# EasyEDA schematic SCH_OnboardRobot_2024-01-02.json
TITLE: Sheet_1; REV: 1.0; Date: 2023-12-17; Sheet: 1/1; Drawn By: RaspberryPiDude314; Company: Your Company
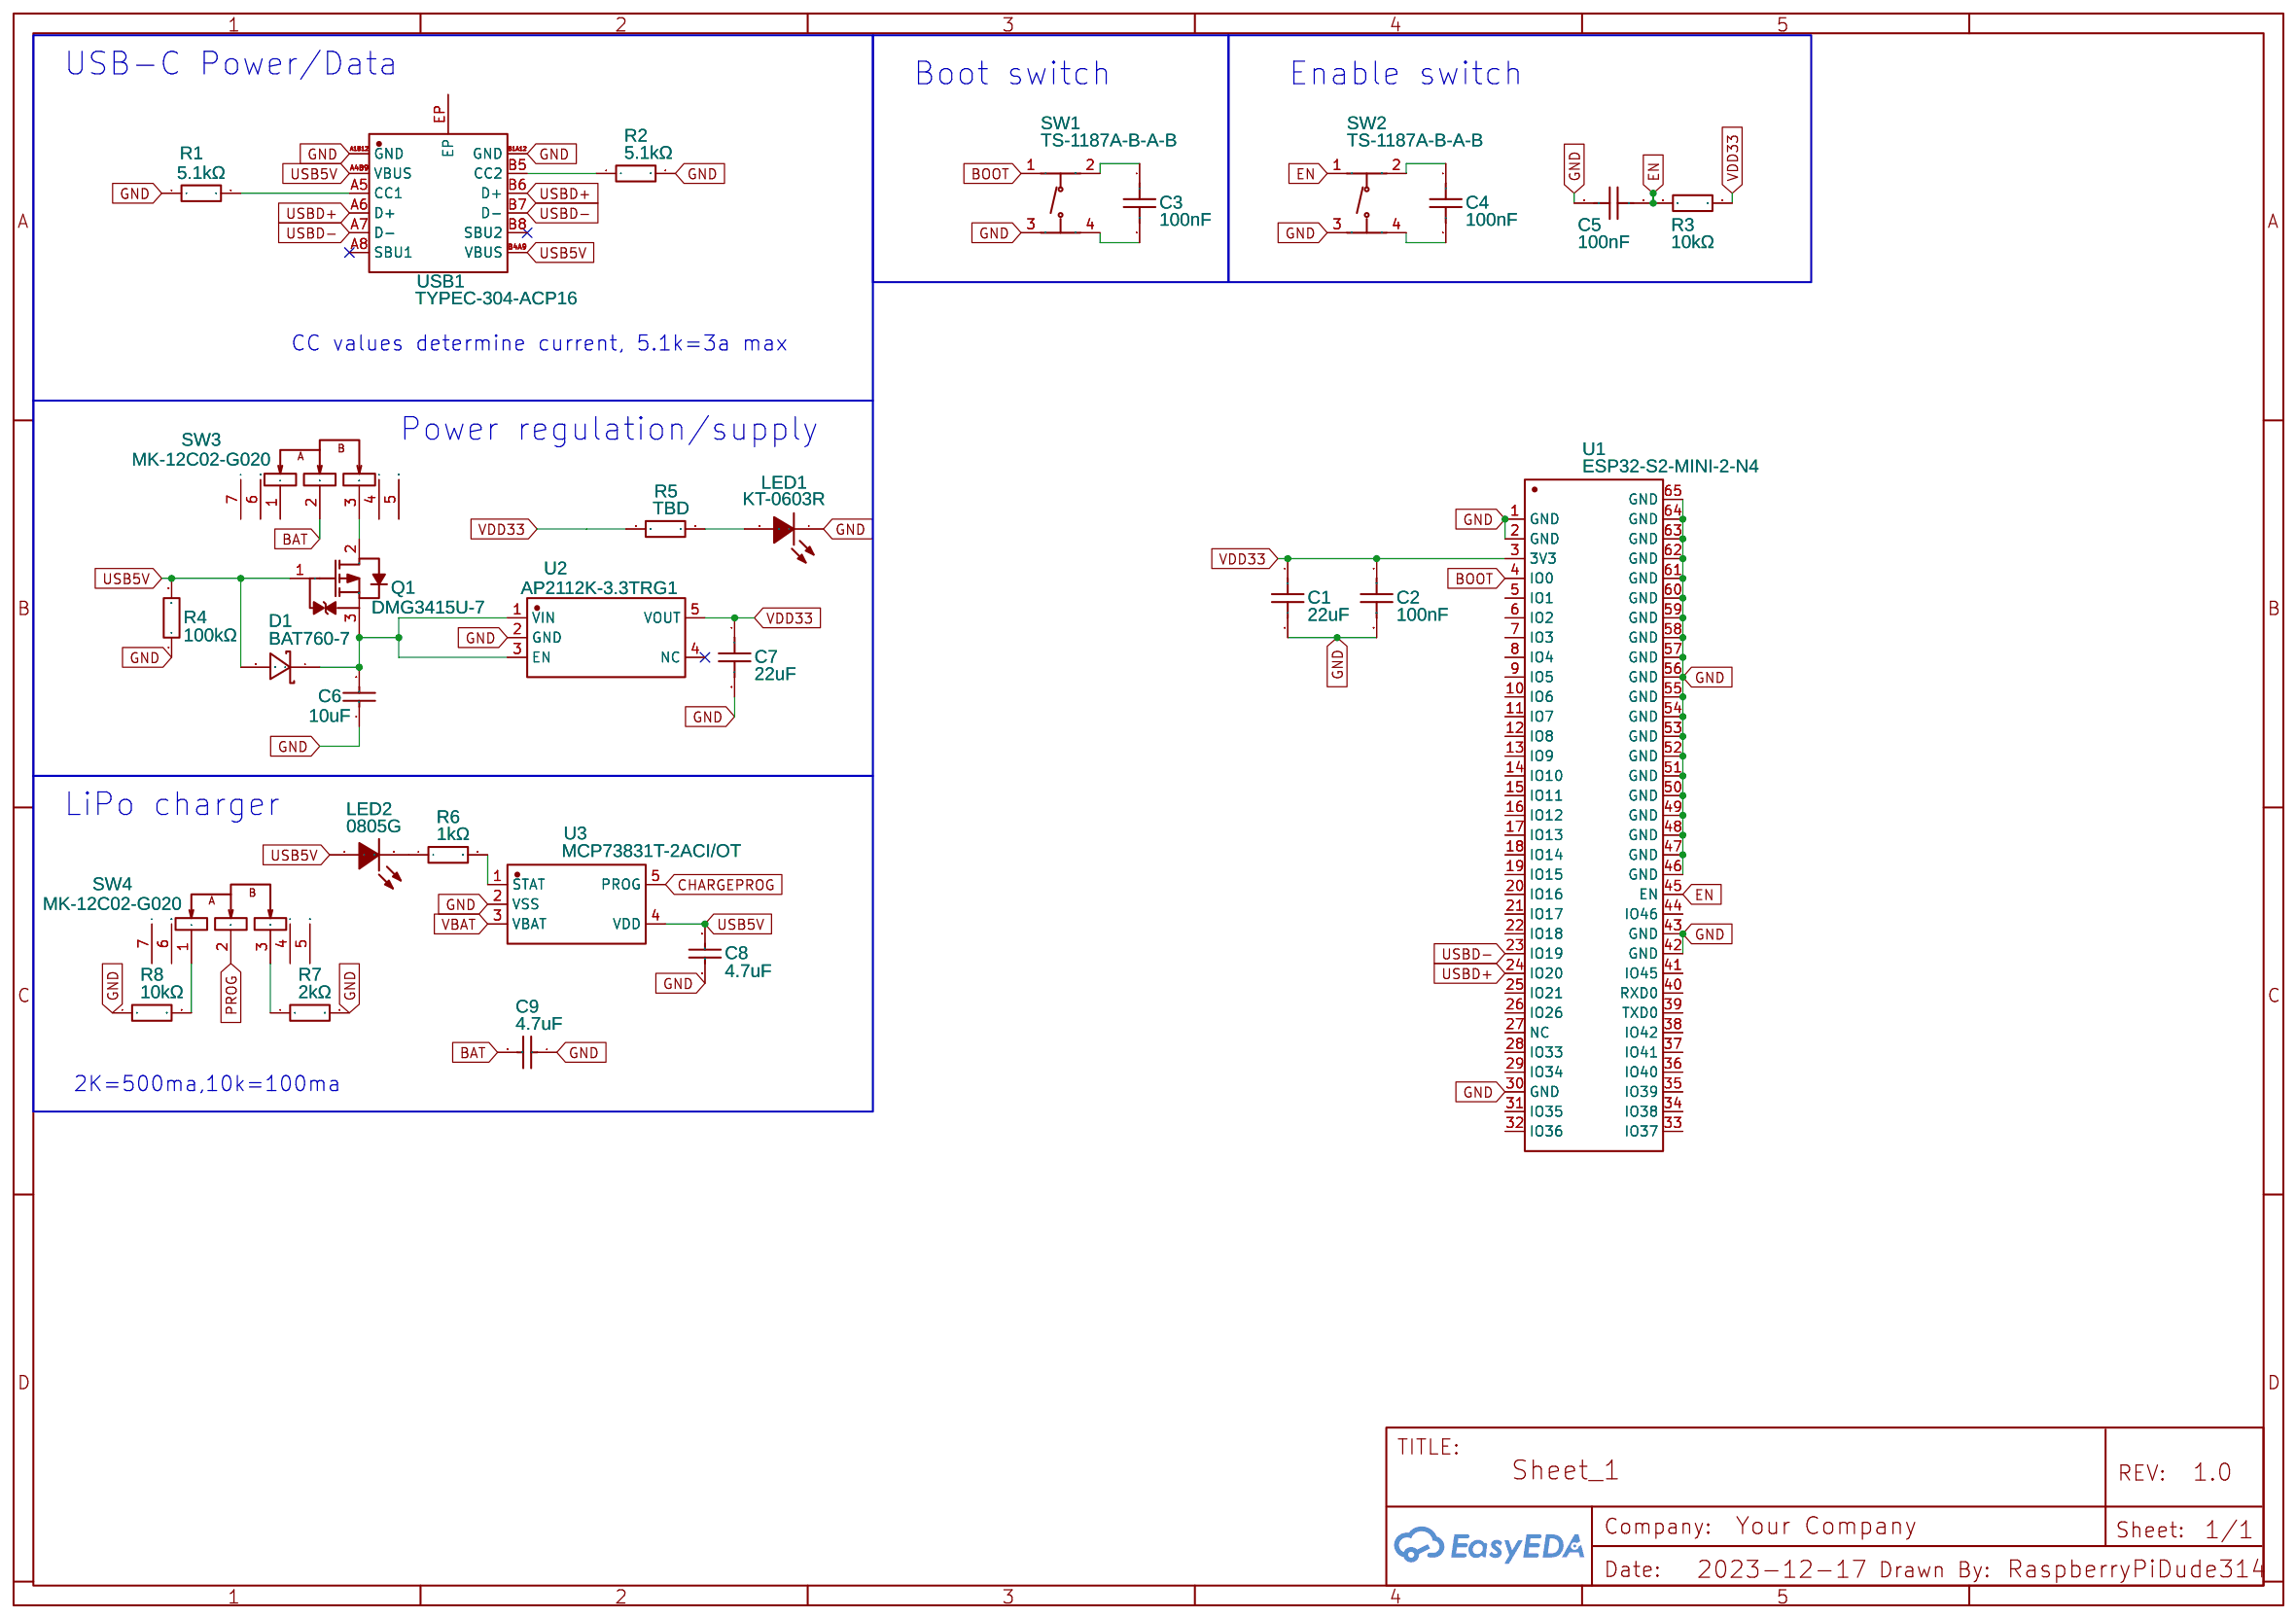
[diagram p0: schematic sheet]

## Parts
C1  22uF  [C0603]
C2  100nF  [C0603]
C3  100nF  [C0603]
C4  100nF  [C0603]
C5  100nF  [C0603]
C6  10uF  [C0805]
C7  22uF  [C0603]
C8  4.7uF  [C0402]
C9  4.7uF  [C0402]
D1  BAT760-7  [SOD-323_L1.8-W1.3-LS2.5-RD]
LED1  KT-0603R  [LED0603-RD]
LED2  0805G  [LED0805-R-RD]
Q1  DMG3415U-7  [SOT-23-3_L2.9-W1.6-P1.90-LS2.8-BR-CW]
R1  5.1kΩ  [R0402]
R2  5.1kΩ  [R0402]
R3  10kΩ  [R0603]
R4  100kΩ  [R1206]
R5  TBD  [0805 RESISTOR FP]
R6  1kΩ  [R0805]
R7  2kΩ  [R0603]
R8  10kΩ  [R0805]
SW1  TS-1187A-B-A-B  [SW-SMD_4P-L5.1-W5.1-P3.70-LS6.5-TL-2]
SW2  TS-1187A-B-A-B  [SW-SMD_4P-L5.1-W5.1-P3.70-LS6.5-TL-2]
SW3  MK-12C02-G020  [SW-SMD_MK-12C02-G020]
SW4  MK-12C02-G020  [SW-SMD_MK-12C02-G020]
U1  ESP32-S2-MINI-2-N4  [WIFI-SMD_ESP32-MINI-1-N4]
U2  AP2112K-3.3TRG1  [SOT-25-5_L2.9-W1.6-P0.95-LS2.8-BL]
U3  MCP73831T-2ACI/OT  [SOT-23-5_L3.0-W1.7-P0.95-LS2.8-BL]
USB1  TYPEC-304-ACP16  [USB-C-SMD_TYPE-C-16P-1]

## Library data of the parts
C1 C7 = CL10A226MQ8NRNC: Supplier: LCSC; Manufacturer: SAMSUNG(三星); Supplier Part: C59461; JLCPCB Part Class: Basic Part
C2-C5 = CC0603KRX7R9BB104: Supplier: LCSC; Manufacturer: YAGEO(国巨); Supplier Part: C14663; JLCPCB Part Class: Basic Part
C6 = CL21A106KAYNNNE: Supplier: LCSC; Manufacturer: SAMSUNG(三星); Supplier Part: C15850; JLCPCB Part Class: Basic Part
C8 C9 = CL05A475MP5NRNC: Supplier: LCSC; Manufacturer: SAMSUNG(三星); Supplier Part: C23733; JLCPCB Part Class: Basic Part
D1 = BAT760-7: Contributor: LCSC; Supplier: LCSC; Manufacturer: DIODES(美台); Supplier Part: C124187; JLCPCB Part Class: Extended Part
LED1 = KT-0603R: Supplier: LCSC; Manufacturer: KENTO; Supplier Part: C2286; JLCPCB Part Class: Basic Part
LED2 = 0805G (Green): Supplier: LCSC; Manufacturer: KENTO; Manufacturer Part: KT-0805翠绿; Supplier Part: C2297; JLCPCB Part Class: Basic Part
Q1 = DMG3415U-7: Contributor: LCSC; Supplier: LCSC; Supplier Part: C96616; Manufacturer: DIODES(美台); JLCPCB Part Class: Extended Part
R1 R2 = 0402WGF5101TCE: Supplier: LCSC; Manufacturer: UNI-ROYAL(厚声); Supplier Part: C25905; JLCPCB Part Class: Basic Part
R3 = 0603WAF1002T5E: Supplier: LCSC; Manufacturer: UNI-ROYAL(厚声); Supplier Part: C25804; JLCPCB Part Class: Basic Part
R4 = 1206W4F1003T5E: Supplier: LCSC; Manufacturer: UNI-ROYAL(厚声); Supplier Part: C17900; JLCPCB Part Class: Basic Part
R5 = 0805 360 ohm Resistor: Contributor: chonghongjin
R6 = 0805W8F1001T5E: Supplier: LCSC; Manufacturer: UNI-ROYAL(厚声); Supplier Part: C17513; JLCPCB Part Class: Basic Part
R7 = 0603WAF2001T5E: Supplier: LCSC; Manufacturer: UNI-ROYAL(厚声); Supplier Part: C22975; JLCPCB Part Class: Basic Part
R8 = 0805W8F1002T5E: Supplier: LCSC; Manufacturer: UNI-ROYAL(厚声); Supplier Part: C17414; JLCPCB Part Class: Basic Part
SW1 SW2 = TS-1187A-B-A-B: Contributor: LCSC; Supplier: LCSC; Supplier Part: C318884; Manufacturer: XKB Connectivity(中国星坤); JLCPCB Part Class: Basic Part
SW3 SW4 = MK-12C02-G020: Contributor: LCSC; Supplier: LCSC; Supplier Part: C963206; Manufacturer: G-Switch; JLCPCB Part Class: Extended Part
U1 = ESP32-S2-MINI-2-N4: Contributor: lcsc; Supplier: LCSC; Supplier Part: C3013906; Manufacturer: ESPRESSIF(乐鑫); JLCPCB Part Class: Extended Part
U2 = AP2112K-3.3TRG1: Contributor: LCSC; Supplier: LCSC; Manufacturer: DIODES(美台); Supplier Part: C51118; JLCPCB Part Class: Extended Part
U3 = MCP73831T-2ACI/OT: Contributor: LCSC; Supplier: LCSC; Supplier Part: C424093; Manufacturer: MICROCHIP(美国微芯); JLCPCB Part Class: Extended Part
USB1 = TYPEC-304-ACP16: Contributor: LCSC; Supplier: LCSC; Supplier Part: C2982555; Manufacturer: XUNPU(讯普); JLCPCB Part Class: Extended Part

## Nets
GND: C1.2 C2.2 C5.1 C6.1 C7.2 C8.1 C9.1 LED1.1(K) R1.1 R2.2 R4.1 R7.2 R8.1 SW1.3(C) SW2.3(C) U1.1(GND) U1.2(GND) U1.30(GND) U1.42(GND) U1.43(GND) U1.46(GND) U1.47(GND) U1.48(GND) U1.49(GND) U1.50(GND) U1.51(GND) U1.52(GND) U1.53(GND) U1.54(GND) U1.55(GND) U1.56(GND) U1.57(GND) U1.58(GND) U1.59(GND) U1.60(GND) U1.61(GND) U1.62(GND) U1.63(GND) U1.64(GND) U1.65(GND) U2.2(GND) U3.2(VSS) USB1.A1B12(GND) USB1.B1A12(GND)
VBAT: U3.3(VBAT)
VDD33: C1.1 C2.1 C7.1 R3.1 R5.1 U1.3(3V3) U2.5(VOUT)
BAT: C9.2 SW3.2
BOOT: SW1.1(A) U1.4(IO0)
CHARGEPROG: U3.5(PROG)
EN: C5.2 R3.2 SW2.1(A) U1.45(EN)
PROG: SW4.2
USB5V: C8.2 D1.2 LED2.1(A) Q1.1(G) R4.2 U3.4(VDD) USB1.A4B9(VBUS) USB1.B4A9(VBUS)
USBD+: U1.24(IO20) USB1.A6(D+) USB1.B6(D+)
USBD-: U1.23(IO19) USB1.A7(D-) USB1.B7(D-)
Net-(C3-1): C3.1 SW1.2(B)
Net-(C3-2): C3.2 SW1.4(D)
Net-(C4-1): C4.1 SW2.2(B)
Net-(C4-2): C4.2 SW2.4(D)
Net-(C6-2): C6.2 D1.1 Q1.3(S) U2.1(VIN) U2.3(EN)
Net-(LED1-2): LED1.2(A) R5.2
Net-(LED2-2): LED2.2(K) R6.1
Net-(Q1-2): Q1.2(D) SW3.3
Net-(R1-2): R1.2 USB1.A5(CC1)
Net-(R2-1): R2.1 USB1.B5(CC2)
Net-(R6-2): R6.2 U3.1(STAT)
Net-(R7-1): R7.1 SW4.3
Net-(R8-2): R8.2 SW4.1

Not connected (* = marked no-connect by the designer): SW3 1 4 5 6 7; SW4 4 5 6 7; U1 5(IO1) 6(IO2) 7(IO3) 8(IO4) 9(IO5) 10(IO6) 11(IO7) 12(IO8) 13(IO9) 14(IO10) 15(IO11) 16(IO12) 17(IO13) 18(IO14) 19(IO15) 20(IO16) 21(IO17) 22(IO18) 25(IO21) 26(IO26) 27(NC) 28(IO33) 29(IO34) 31(IO35) 32(IO36) 33(IO37) 34(IO38) 35(IO39) 36(IO40) 37(IO41) 38(IO42) 39(TXD0) 40(RXD0) 41(IO45) 44(IO46); U2 4(NC)*; USB1 A8(SBU1)* B8(SBU2)* EP

## Notes on the sheet
- USB-C Power/Data
- Boot switch
- Enable switch
- CC values determine current, 5.1k=3a max
- Power regulation/supply
- LiPo charger
- 2K=500ma,10k=100ma
